# EAGLE design flower (EAGLE 7.7.0)
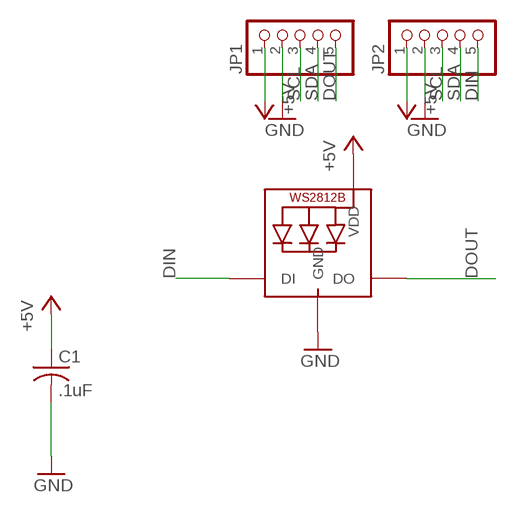
[diagram p0: schematic, sheet 1]

## Parts
C1  .1uF  C-USC0805  [C0805]
JP1  PINHD-1X55X2MM  [1_05X2MM]
JP2  PINHD-1X55X2MM  [1_05X2MM]
LED1  WS2812B_5050N  [WS2812B-NARROW]

## Nets
+5V: C1.1 JP1.1 JP2.1 LED1.1-VDD(VDD)
DIN: JP2.5 LED1.4-DIN(DI)
DOUT: JP1.5 LED1.2-DOUT(DO)
GND: C1.2 JP1.2 JP2.2 LED1.3-GND(GND)
SCL: JP1.3 JP2.3
SDA: JP1.4 JP2.4

## Library data of the parts
C1 = resistor:C-US: CAPACITOR, American symbol
JP1 JP2 = pinhead:PINHD-1X5: PIN HEADER
LED1 = adafruit:WS2812B

## Board
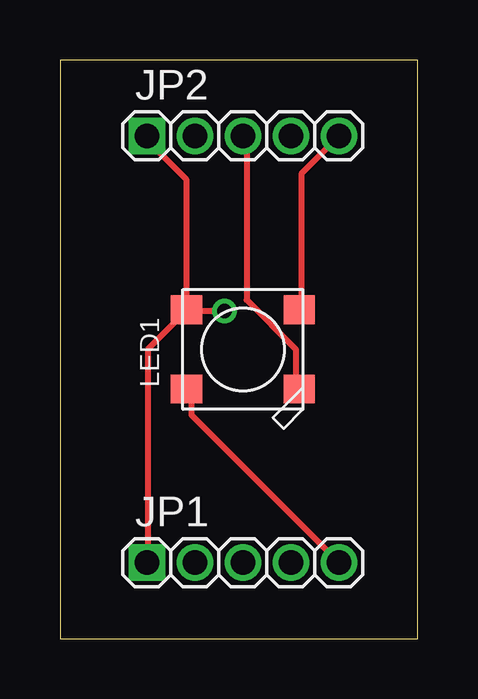
[diagram p1: board, top side]
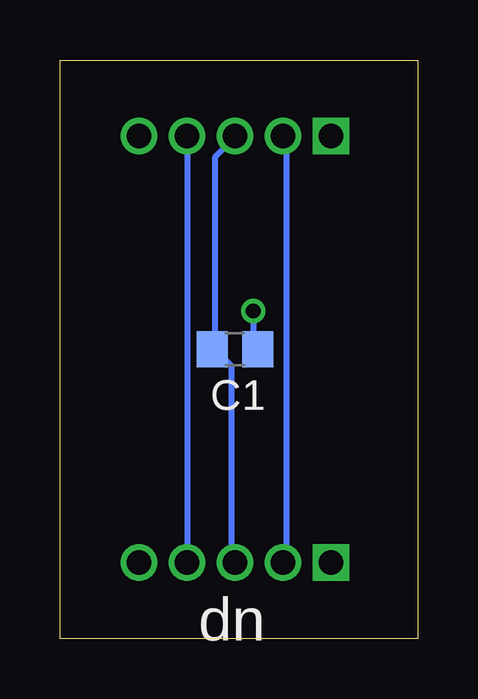
[diagram p2: board, bottom side, seen from below]

Size 14.91 x 24.12 mm. Coordinates in mm from the lower left corner, seen from the top.
Outline: 0,0 14.91,0 14.91,24.12 0,24.12 0,0
Copper layers (1*16): Top 0.035mm / dielectric 1.5mm / Bottom 0.035mm
Design rules "default": minimum track width 10mil, minimum drill 24mil, track to track 8mil, track to pad 8mil, pad to pad 8mil, via to via 8mil, smd to smd 8mil, copper to edge 40mil, drill to drill 8mil, minimum pad ring 10mil, minimum via ring 8mil, stop-mask expansion 4mil, vias tented up to drill 0mil, thermal gap 10mil

### Footprints (pad centres in the part's own frame; a part is rotated, then mirrored left to right if it is on the bottom)
C0805 = smd 1.3 x 1.5: 1 -0.95,0; 2 0.95,0
1_05X2MM = drill 1.016 pad 1.3 square: 1 -4,0 | drill 1.016 pad 1.3: 2 0,0; 3 -2,0; 4 2,0; 5 4,0
WS2812B-NARROW = smd 1.3 x 1.2: 1-VDD 2.35,-1.65; 2-DOUT 2.35,1.65; 3-GND -2.35,1.65; 4-DIN -2.35,-1.65

### Placement (x,y rotation side)
C1  7.62,12.06 180 bottom
JP1  7.62,3.17 0 top
JP2  7.62,20.95 0 top
LED1  7.62,12.06 180 top

### Tracks (layer width: path | path; a pad name or v marks a point on that pad's centre or on a via)
+5V  (via drill 0.61)
  Top 0.254: LED1.1-VDD 5.26,13.89 5.26,19.15 3.66,20.75 JP2.1 | v6.86,13.66 5.49,13.66 LED1.1-VDD | JP1.1 3.66,3.38 3.66,12.06 5.26,13.66 LED1.1-VDD
  Bottom 0.254: v6.86,13.66 6.86,12.06 C1.1
DIN
  Top 0.254: LED1.4-DIN 10.06,13.89 10.06,19.38 11.43,20.75 JP2.5
DOUT
  Top 0.254: LED1.2-DOUT 5.49,10.24 5.49,9.32 11.43,3.38 JP1.5
GND
  Top 0.254: LED1.3-GND 9.83,10.46 9.83,12.06 7.77,14.12 7.77,20.75 JP2.2
  Bottom 0.254: 8.46,12.06 8.46,20.07 7.77,20.75 JP2.2 | 8.46,12.06 7.77,11.38 7.77,3.38 JP1.2 | 8.46,12.06 C1.2
SCL
  Bottom 0.254: JP1.3 5.49,3.38 5.49,20.75 JP2.3
SDA
  Bottom 0.254: JP1.4 9.6,3.38 9.6,20.75 JP2.4

### Text on the board
bNames: up